# Altium schematic sheet Connector.SchDoc: QUTMS Shutdown V2 - Connector
size A4; Organization: QUT Motorsport; Address1: O-120; Address2: O Block; Address3: QUT Gardens Point; Address4: Brisbane, 4000; DocumentNumber: 3; SheetNumber: 3; SheetTotal: 10
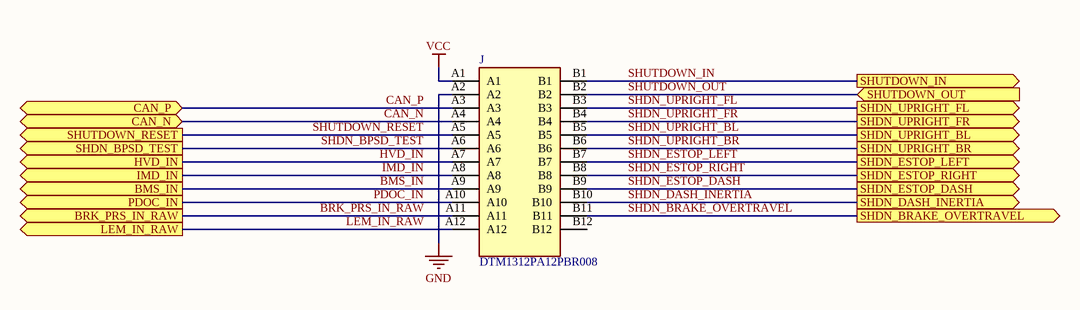
[diagram p0: Connector.SchDoc]

## Parts
J  DTM1312PA12PBR008  [TE_DTM1312PA12PBR008]

## Ports
BMS_IN (out), BRK_PRS_IN_RAW (out), CAN_N (bidir), CAN_P (bidir), HVD_IN (out), IMD_IN (out), LEM_IN_RAW (out), PDOC_IN (out), SHDN_BPSD_TEST (out), SHDN_BRAKE_OVERTRAVEL (out), SHDN_DASH_INERTIA (out), SHDN_ESTOP_DASH (out), SHDN_ESTOP_LEFT (out), SHDN_ESTOP_RIGHT (out), SHDN_UPRIGHT_BL (out), SHDN_UPRIGHT_BR (out), SHDN_UPRIGHT_FL (out), SHDN_UPRIGHT_FR (out), SHUTDOWN_IN (out), SHUTDOWN_OUT (in), SHUTDOWN_RESET (out)

## Nets
GND: J.A2
VCC: J.A1
BMS_IN: J.A9 ; port BMS_IN
BRK_PRS_IN_RAW: J.A11 ; port BRK_PRS_IN_RAW
CAN_N: J.A4 ; port CAN_N
CAN_P: J.A3 ; port CAN_P
HVD_IN: J.A7 ; port HVD_IN
IMD_IN: J.A8 ; port IMD_IN
LEM_IN_RAW: J.A12 ; port LEM_IN_RAW
PDOC_IN: J.A10 ; port PDOC_IN
SHDN_BPSD_TEST: J.A6 ; port SHDN_BPSD_TEST
SHDN_BRAKE_OVERTRAVEL: J.B11 ; port SHDN_BRAKE_OVERTRAVEL
SHDN_DASH_INERTIA: J.B10 ; port SHDN_DASH_INERTIA
SHDN_ESTOP_DASH: J.B9 ; port SHDN_ESTOP_DASH
SHDN_ESTOP_LEFT: J.B7 ; port SHDN_ESTOP_LEFT
SHDN_ESTOP_RIGHT: J.B8 ; port SHDN_ESTOP_RIGHT
SHDN_UPRIGHT_BL: J.B5 ; port SHDN_UPRIGHT_BL
SHDN_UPRIGHT_BR: J.B6 ; port SHDN_UPRIGHT_BR
SHDN_UPRIGHT_FL: J.B3 ; port SHDN_UPRIGHT_FL
SHDN_UPRIGHT_FR: J.B4 ; port SHDN_UPRIGHT_FR
SHUTDOWN_IN: J.B1 ; port SHUTDOWN_IN
SHUTDOWN_OUT: J.B2 ; port SHUTDOWN_OUT
SHUTDOWN_RESET: J.A5 ; port SHUTDOWN_RESET

Not connected (* = marked no-connect by the designer): J B12

## Notes on the sheet
- Title
- Size:
- Date:
- A4
- Number:
- Time:
- Revision:
- Sheet
- of
- File:

## Library data of the parts
J = DTM1312PA12PBR008: 24 way sealed A and B key PCB header with .165 inch/4.2 millimeter centerline pitch.; MP: DTM13-12PA-12PB-R008; MF: TE Connectivity; Digi-Key_Part_Number: 1734-1131-ND; Digi-Key_Purchase_URL: https://www.digikey.com/product-detail/en/te-connectivity-deutsch-connectors/DTM13-12PA-12PB-R008/1734-1131-ND/6566695?utm_source=snapeda&utm_medium=aggregator&utm_campaign=symbol; Package: None; Value: *; TE_purchase_URL: https://www.te.com/usa-en/product-DTM1312PA12PBR008.html?te_bu=Cor&te_type=disp&te_campaign=seda_glo_cor-seda-global-disp-prtnr-fy19-seda-model-bom-cta_sma-317_1&elqCampaignId=32493; SnapEDA_Link: https://www.snapeda.com/parts/DTM13-12PA-12PB-R008/TE%20Connectivity%20Deutsch%20Connectors/view-part/490507/?ref=snap